# Altium project Isaac MSP430 Subsystem.PrjPcb
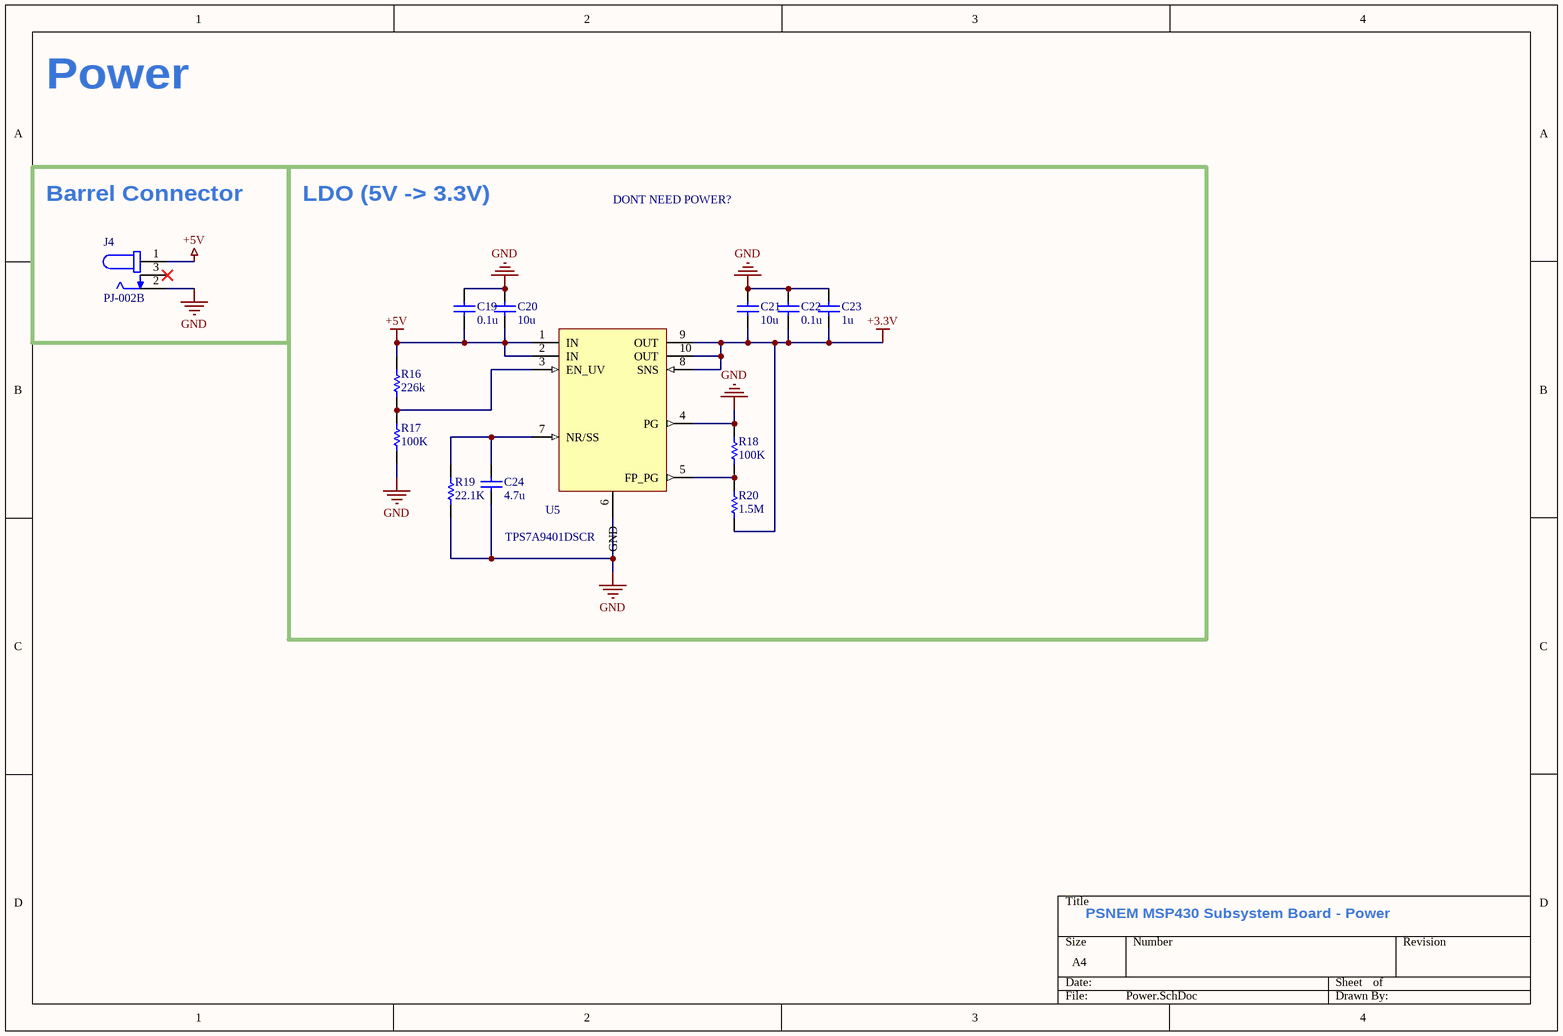
[diagram p0: Power.SchDoc]
4 sheets, 40 parts. Net scope: hierarchical (ports join the sheet entries above them; power ports are global).
Board file: PSNEM-MCU-Subsystem.PcbDoc
Sheets:
  Power.SchDoc
  Overview.SchDoc
    U_Connectors = Connectors.SchDoc
    U_MicroController = MicroController.SchDoc
    U_Connectors = Connectors.SchDoc

## Sheet Power.SchDoc
size A4; SheetNumber: 5; SheetTotal: 5

### Parts
(Parts that share a designator on the sheet are numbered #1, #2 ... from top to bottom, then left to right.)
C19#1  0.1u  [0805 Cap]
C20#1  10u  [0805 Cap]
C21  10u  [0805 Cap]
C22  0.1u  [0805 Cap]
C23  1u  [0805 Cap]
C24  4.7u  [0805 Cap]
J4  PJ-002B  [PJ-002B]
R16#1  226k  [RESC1608X06N]
R17#1  100K  [RESC1608X06N]
R18#1  100K  [RESC1608X06N]
R19#1  22.1K  [RESC1608X06N]
R20  1.5M  [RESC1608X06N]
U5  TPS7A9401DSCR  [TPS7A9401DSCR]

### Blocks framed on the sheet
Barrel Connector: J4
LDO (5V -> 3.3V): C19#1 C20#1 C21-C24 R16#1 R17#1 R18#1 R19#1 R20 U5

### Nets
+3.3V: C21.1 C22.1 C23.2 R20.1 U5.8(SNS) U5.9(OUT) U5.10(OUT)
+5V: C19#1.2 C20#1.1 J4.1 R16#1.2 U5.1(IN) U5.2(IN)
GND: C19#1.1 C20#1.2 C21.2 C22.2 C23.1 C24.1 J4.2 R17#1.1 R18#1.2 R19#1.1 U5.4(PG)
NetC24_2: C24.2 R19#1.2 U5.7(NR/SS)
NetR16#1_1: R16#1.1 R17#1.2 U5.3(EN_UV)
NetR18#1_1: R18#1.1 R20.2 U5.5(FP_PG)

Not connected (* = marked no-connect by the designer): J4 3*; U5 6(GND)

### Notes on the sheet
- Power
- DONT NEED POWER?
- PSNEM MSP430 Subsystem Board - Power

### Library data of the parts
C19#1 C22 = CC0805KRX7R9BB104: 0.1 µF ±10% 50V Ceramic Capacitor X7R 0805 (2012 Metric); value: 0.1u
C20#1 C21 = CL21B106KPQNNNE: 10 µF ±10% 10V Ceramic Capacitor X7R 0805 (2012 Metric); value: 10u
C23 = CC0805KKX7R7BB105: 1 µF ±10% 16V Ceramic Capacitor X7R 0805 (2012 Metric); value: 1u
C24 = CL21B475KOFNFNE: 4.7 µF ±10% 16V Ceramic Capacitor X7R 0805 (2012 Metric); value: 4.7u
J4 = PJ-002B: Power Barrel Connector Jack 2.50mm ID (0.098"), 5.50mm OD (0.217") Through Hole, Right Angle
R16#1 = RN73H1JTTD2263B25: Thin Film Resistors - SMD 226kOhm,0603,0.1%,25; value: 226k
R17#1 R18#1 = ERA-3VRW1003V: Thin Film Resistors - SMD 0603 0.05% 100Kohm 10ppm SMD; value: 100K
R19#1 = TNPW060322K1BEEA: Thin Film Resistors - SMD 22.1Kohms .1% 25ppm; value: 22.1K
R20 = MCT0603MD1504BP500: Thin Film Resistors - SMD .125W 1.5Mohms .1% 0603 25ppm; value: 1.5M
U5 = TPS7A9401DSCR: Linear Voltage Regulator IC Positive Adjustable 1 Output 1A 10-WSON (3x3); Manufacturer: Texas Instruments; Manufacturer PN: TPS7A9401DSCR

## Sheet Overview.SchDoc
size A; SheetNumber: 1; SheetTotal: 4
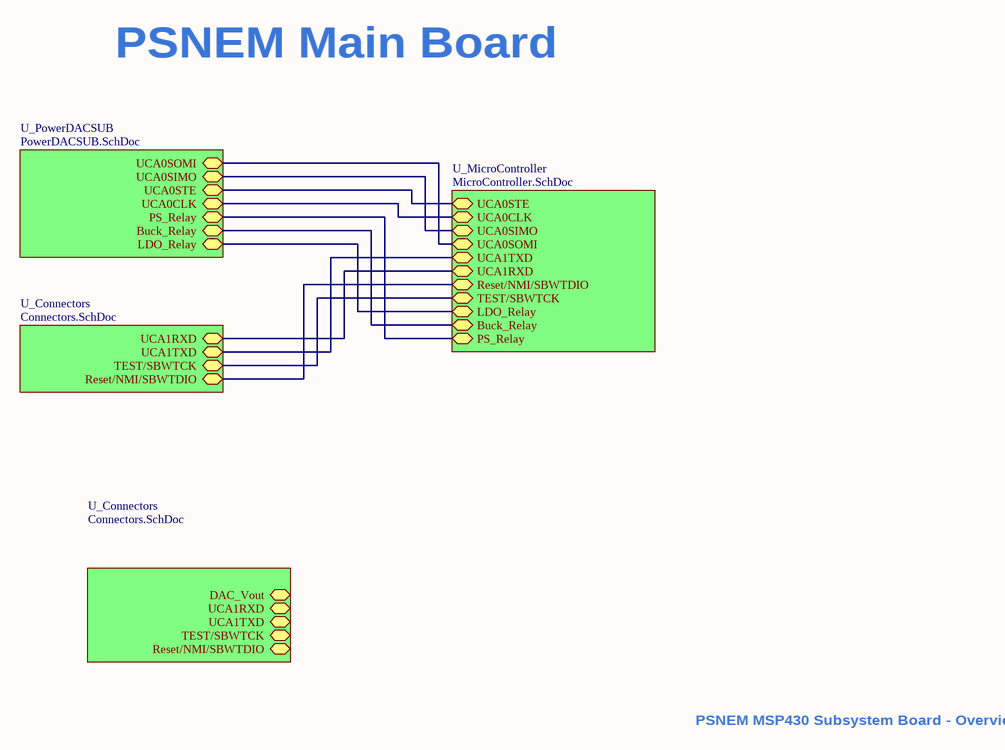
[diagram p1: Overview.SchDoc]

### Sub-sheets
U_Connectors = Connectors.SchDoc: Reset/NMI/SBWTDIO (bidir), TEST/SBWTCK (bidir), UCA1TXD (bidir), UCA1RXD (bidir)
U_Connectors = Connectors.SchDoc: Reset/NMI/SBWTDIO (bidir), TEST/SBWTCK (bidir), UCA1TXD (bidir), UCA1RXD (bidir), DAC_Vout (bidir)
U_MicroController = MicroController.SchDoc: UCA0STE (bidir), UCA0CLK (bidir), UCA0SIMO (bidir), UCA0SOMI (bidir), UCA1TXD (bidir), UCA1RXD (bidir), Reset/NMI/SBWTDIO (bidir), TEST/SBWTCK (bidir), LDO_Relay (bidir), Buck_Relay (bidir), PS_Relay (bidir)
U_PowerDACSUB = PowerDACSUB.SchDoc (file not in this document): LDO_Relay (bidir), Buck_Relay (bidir), PS_Relay (bidir), UCA0CLK (bidir), UCA0STE (bidir), UCA0SIMO (bidir), UCA0SOMI (bidir)

### Nets
NetC18_U_Connectors#1_2: sheet U_Connectors/Reset/NMI/SBWTDIO, sheet U_MicroController/Reset/NMI/SBWTDIO
NetJ3_U_Connectors#1_7: sheet U_Connectors/TEST/SBWTCK, sheet U_MicroController/TEST/SBWTCK
NetJ4_U_Connectors#1_1: sheet U_Connectors/UCA1TXD, sheet U_MicroController/UCA1TXD
NetJ4_U_Connectors#1_3: sheet U_Connectors/UCA1RXD, sheet U_MicroController/UCA1RXD
NetR12_1: sheet U_MicroController/LDO_Relay, sheet U_PowerDACSUB/LDO_Relay
NetR13_1: sheet U_MicroController/Buck_Relay, sheet U_PowerDACSUB/Buck_Relay
NetR14_1: sheet U_MicroController/PS_Relay, sheet U_PowerDACSUB/PS_Relay
NetU4_10: sheet U_MicroController/UCA0STE, sheet U_PowerDACSUB/UCA0STE
NetU4_11: sheet U_MicroController/UCA0CLK, sheet U_PowerDACSUB/UCA0CLK
NetU4_24: sheet U_MicroController/UCA0SIMO, sheet U_PowerDACSUB/UCA0SIMO
NetU4_25: sheet U_MicroController/UCA0SOMI, sheet U_PowerDACSUB/UCA0SOMI

### Notes on the sheet
- PSNEM Main Board
- PSNEM MSP430 Subsystem Board - Overview

## Sheet Connectors.SchDoc
size A4; SheetNumber: 3; SheetTotal: 4
Used 2 times, as channels U_Connectors, U_Connectors. Parts and nets are listed once, with the designators drawn on the sheet.
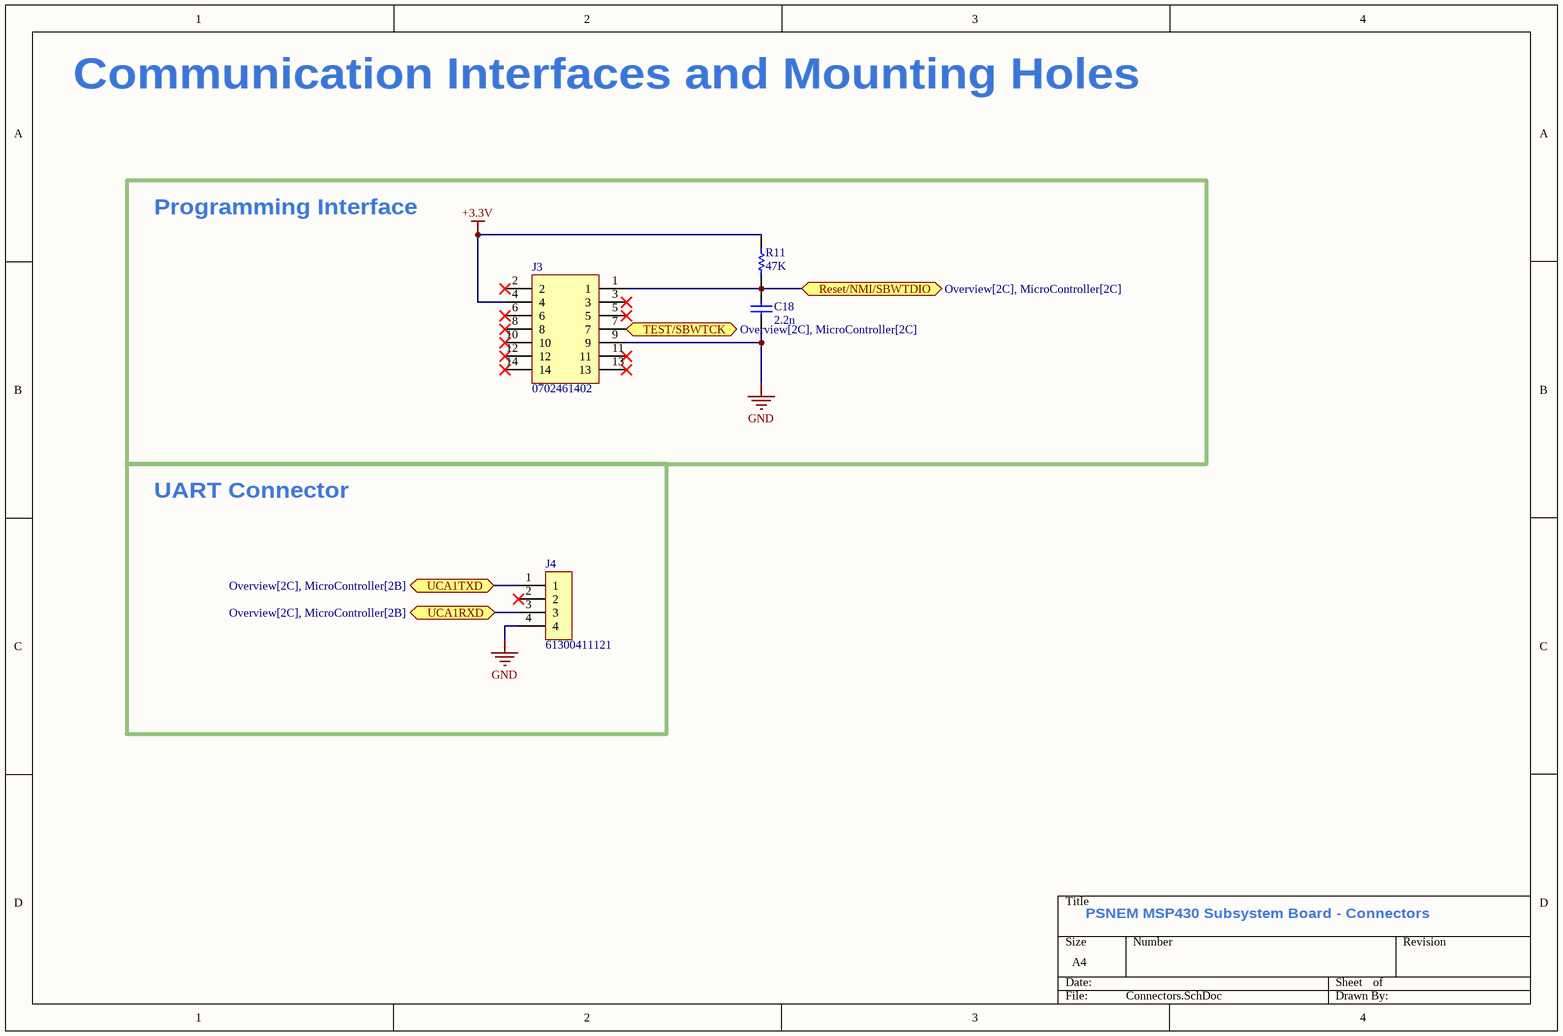
[diagram p2: Connectors.SchDoc]

### Parts
C18  2.2n  [0805 Cap]
J3  0702461402  [0702461402]
J4  61300411121  [61300411121]
R11  47K  [RESC1608X06N]

### Blocks framed on the sheet
Programming Interface: C18 J3 R11
UART Connector: J4

### Ports
Reset/NMI/SBWTDIO (bidir, see Overview[2C], MicroController[2C]), TEST/SBWTCK (bidir, see Overview[2C], MicroController[2C]), UCA1RXD (bidir, see Overview[2C], MicroController[2B]), UCA1TXD (bidir, see Overview[2C], MicroController[2B])

### Nets
+3.3V: J3.4 R11.2
GND: C18.1 J3.9 J4.4
Reset/NMI/SBWTDIO: C18.2 J3.1 R11.1 ; port Reset/NMI/SBWTDIO
TEST/SBWTCK: J3.7 ; port TEST/SBWTCK
UCA1RXD: J4.3 ; port UCA1RXD
UCA1TXD: J4.1 ; port UCA1TXD

Not connected (* = marked no-connect by the designer): J3 2* 3* 5* 6* 8* 10* 11* 12* 13* 14*; J4 2*

### Channels
U_Connectors: designators end in _U_Connectors#1; ports Reset/NMI/SBWTDIO=NetC18_U_Connectors#1_2 TEST/SBWTCK=NetJ3_U_Connectors#1_7 UCA1RXD=NetJ4_U_Connectors#1_3 UCA1TXD=NetJ4_U_Connectors#1_1
U_Connectors: designators end in _U_Connectors#2; ports Reset/NMI/SBWTDIO=NetC18_U_Connectors#2_2 TEST/SBWTCK=NetJ3_U_Connectors#2_7 UCA1RXD=NetJ4_U_Connectors#2_3 UCA1TXD=NetJ4_U_Connectors#2_1

### Notes on the sheet
- Communication Interfaces and Mounting Holes
- PSNEM MSP430 Subsystem Board - Connectors

### Library data of the parts
C18 = CC0805KRX7R9BB222: 2200 pF ±10% 50V Ceramic Capacitor X7R 0805 (2012 Metric); value: 2.2n
J3 = 0702461402: Connector Header Through Hole 14 position 0.100" (2.54mm)
J4 = 61300411121: Connector Header Through Hole 4 position 0.100" (2.54mm)
R11 = ERA-3VEB4702V: Thin Film Resistors - SMD 0603 0.1% 47Kohm 25ppm SMD; value: 47K

## Sheet MicroController.SchDoc
size A3; SheetNumber: 4; SheetTotal: 4
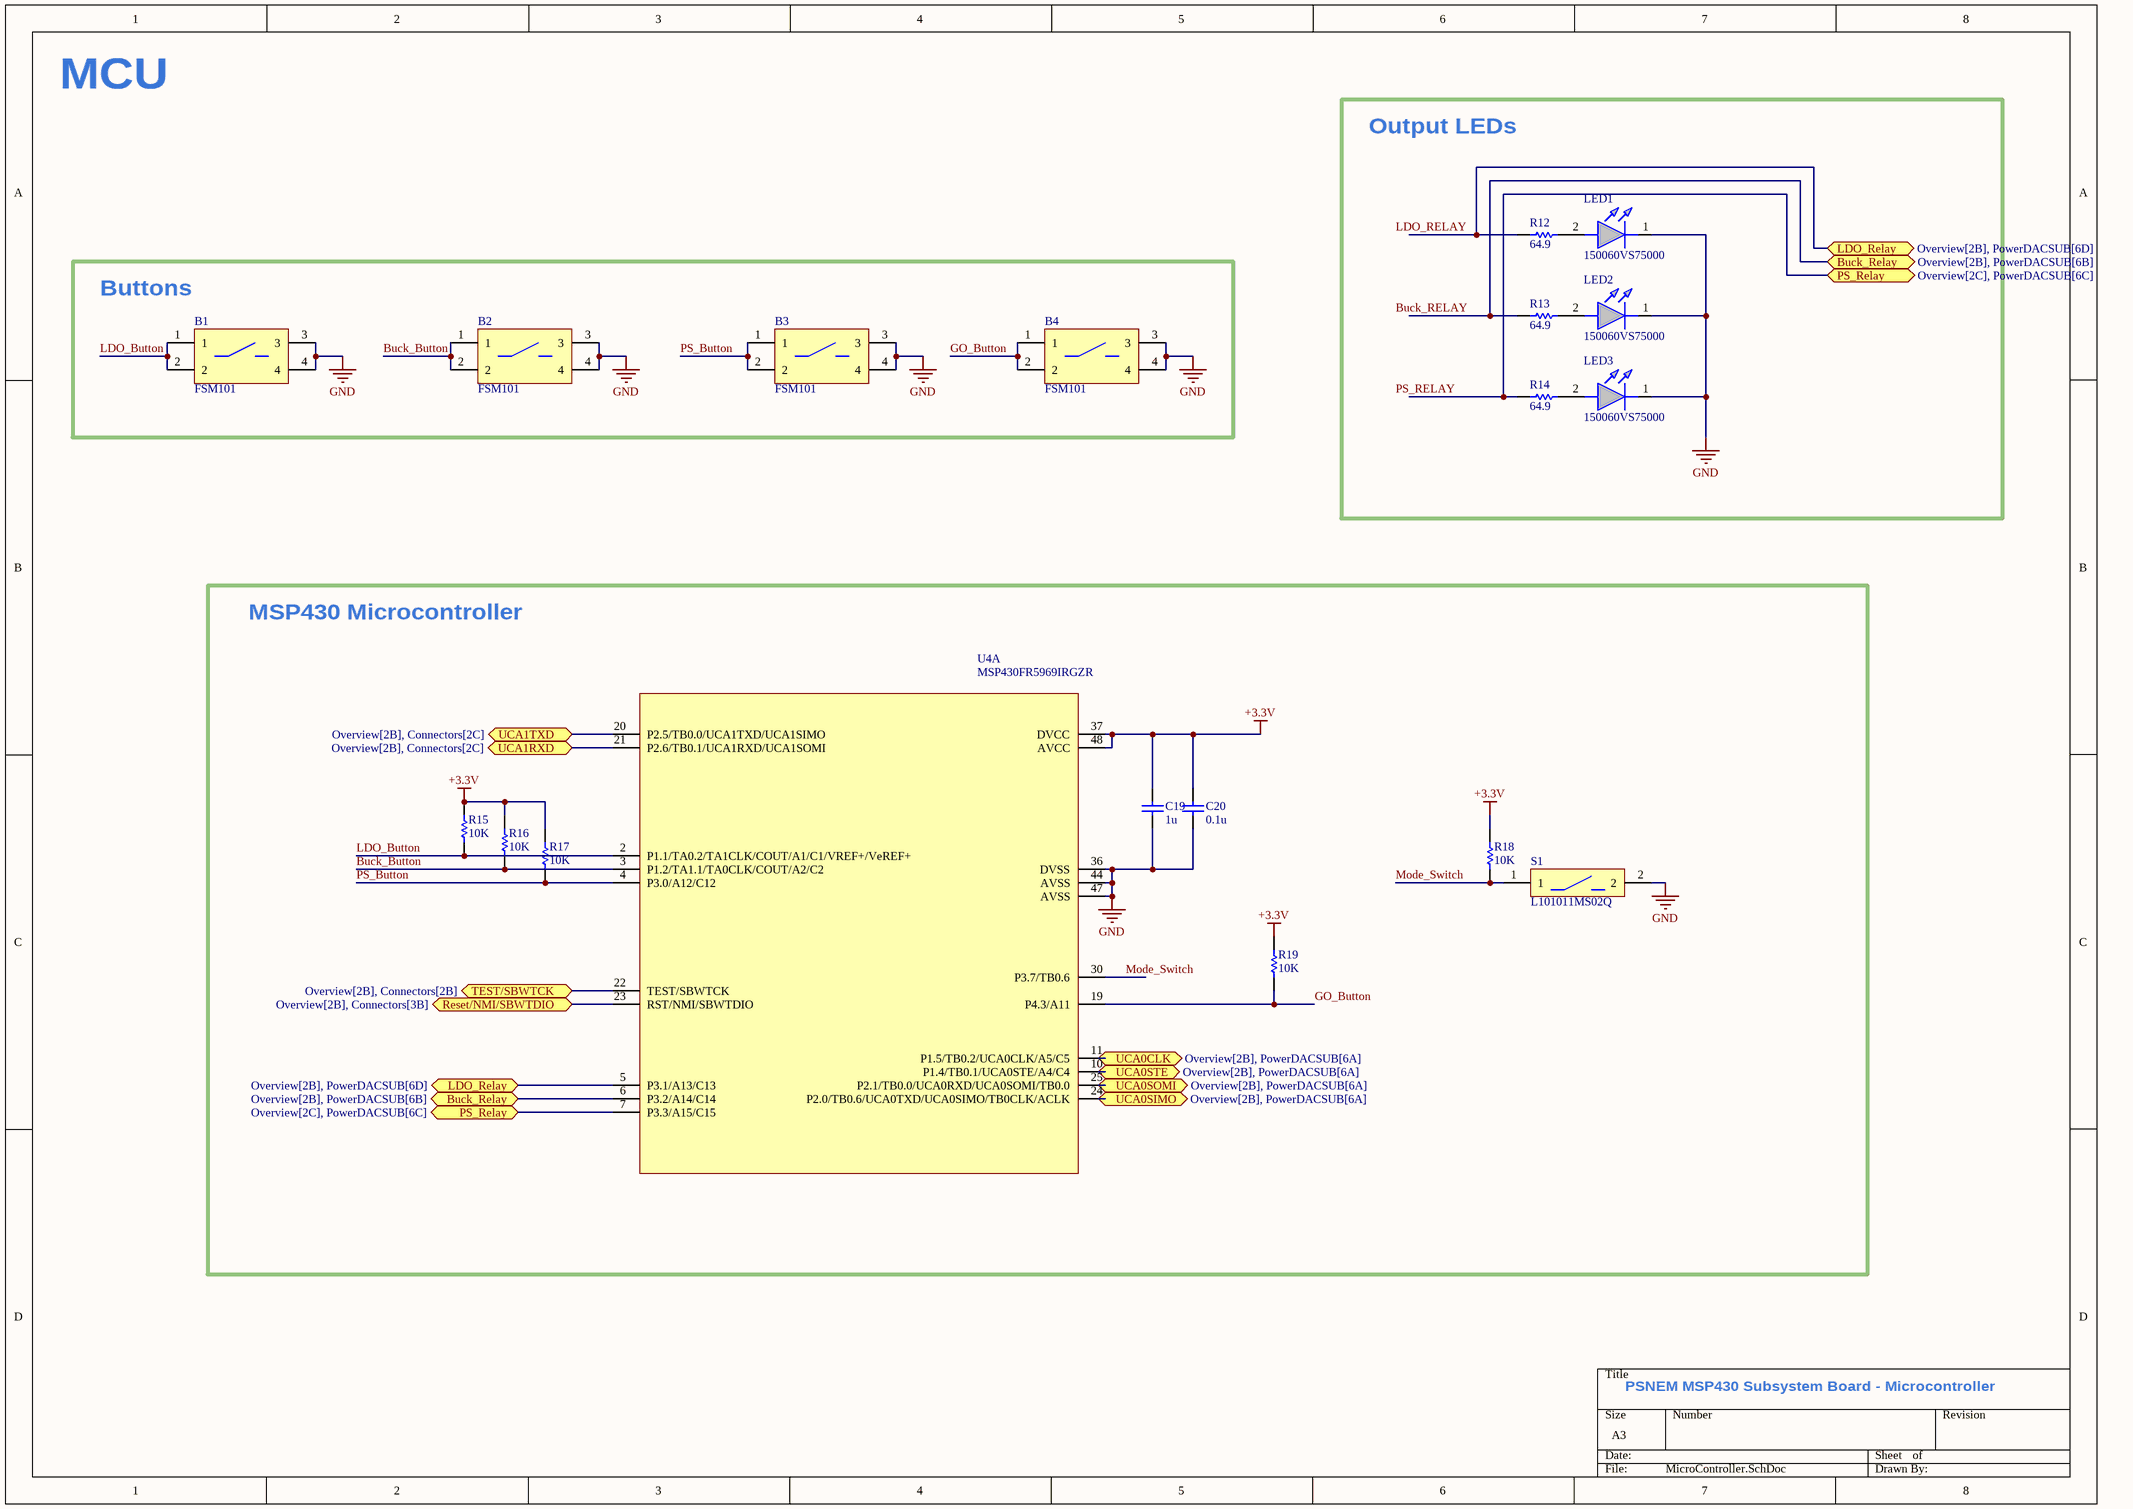
[diagram p3: MicroController.SchDoc]

### Parts
(Parts that share a designator on the sheet are numbered #1, #2 ... from top to bottom, then left to right.)
B1  FSM101  [FSM101]
B2  FSM101  [FSM101]
B3  FSM101  [FSM101]
B4  FSM101  [FSM101]
C19#2  1u  [0805 Cap]
C20#2  0.1u  [0805 Cap]
LED1  150060VS75000  [150060VS75000]
LED2  150060VS75000  [150060VS75000]
LED3  150060VS75000  [150060VS75000]
R12  64.9  [RESC1608X06N]
R13  64.9  [RESC1608X06N]
R14  64.9  [RESC1608X06N]
R15  10K  [RESC1608X06N]
R16#2  10K  [RESC1608X06N]
R17#2  10K  [RESC1608X06N]
R18#2  10K  [RESC1608X06N]
R19#2  10K  [RESC1608X06N]
S1  L101011MS02Q  [L101011MS02Q]
U4  MSP430FR5969IRGZR  [MSP430FR5969IRGZR]  (part A of 2)

### Blocks framed on the sheet
Output LEDs: LED1-LED3 R12-R14
Buttons: B1-B4
MSP430 Microcontroller: C19#2 C20#2 R15 R16#2 R17#2 R18#2 R19#2 S1 U4

### Ports
Buck_Relay (bidir, see Overview[2B], PowerDACSUB[6B]), LDO_Relay (bidir, see Overview[2B], PowerDACSUB[6D]), PS_Relay (bidir, see Overview[2C], PowerDACSUB[6C]), Reset/NMI/SBWTDIO (bidir, see Overview[2B], Connectors[3B]), TEST/SBWTCK (bidir, see Overview[2B], Connectors[2B]), UCA0CLK (bidir, see Overview[2B], PowerDACSUB[6A]), UCA0SIMO (bidir, see Overview[2B], PowerDACSUB[6A]), UCA0SOMI (bidir, see Overview[2B], PowerDACSUB[6A]), UCA0STE (bidir, see Overview[2B], PowerDACSUB[6A]), UCA1RXD (bidir, see Overview[2B], Connectors[2C]), UCA1TXD (bidir, see Overview[2B], Connectors[2C])

### Nets
+3.3V: C19#2.2 C20#2.2 R15.2 R16#2.2 R17#2.2 R18#2.2 R19#2.2 U4.37(DVCC) U4.48(AVCC)
GND: B1.3 B1.4 B2.3 B2.4 B3.3 B3.4 B4.3 B4.4 C19#2.1 C20#2.1 LED1.1(K) LED2.1(K) LED3.1(K) S1.2 U4.36(DVSS) U4.44(AVSS) U4.47(AVSS)
Buck_Button: B2.1 B2.2 R16#2.1 U4.3(P1.2/TA1.1/TA0CLK/COUT/A2/C2)
GO_Button: B4.1 B4.2 R19#2.1 U4.19(P4.3/A11)
LDO_Button: B1.1 B1.2 R15.1 U4.2(P1.1/TA0.2/TA1CLK/COUT/A1/C1/VREF+/VeREF+)
Mode_Switch: R18#2.1 S1.1 U4.30(P3.7/TB0.6)
PS_Button: B3.1 B3.2 R17#2.1 U4.4(P3.0/A12/C12)
NetC18_U_Connectors#1_2: U4.23(RST/NMI/SBWTDIO) ; port Reset/NMI/SBWTDIO
NetJ3_U_Connectors#1_7: U4.22(TEST/SBWTCK) ; port TEST/SBWTCK
NetJ4_U_Connectors#1_1: U4.20(P2.5/TB0.0/UCA1TXD/UCA1SIMO) ; port UCA1TXD
NetJ4_U_Connectors#1_3: U4.21(P2.6/TB0.1/UCA1RXD/UCA1SOMI) ; port UCA1RXD
NetLED1_2: LED1.2(A) R12.2
NetLED2_2: LED2.2(A) R13.2
NetLED3_2: LED3.2(A) R14.2
NetR12_1: R12.1 U4.5(P3.1/A13/C13) ; port LDO_Relay
NetR13_1: R13.1 U4.6(P3.2/A14/C14) ; port Buck_Relay
NetR14_1: R14.1 U4.7(P3.3/A15/C15) ; port PS_Relay
NetU4_10: U4.10(P1.4/TB0.1/UCA0STE/A4/C4) ; port UCA0STE
NetU4_11: U4.11(P1.5/TB0.2/UCA0CLK/A5/C5) ; port UCA0CLK
NetU4_24: U4.24(P2.0/TB0.6/UCA0TXD/UCA0SIMO/TB0CLK/ACLK) ; port UCA0SIMO
NetU4_25: U4.25(P2.1/TB0.0/UCA0RXD/UCA0SOMI/TB0.0) ; port UCA0SOMI

### Notes on the sheet
- MCU
- PSNEM MSP430 Subsystem Board - Microcontroller
- Labels drawn without touching a wire or pin: Buck_RELAY, LDO_RELAY, PS_RELAY

### Library data of the parts
B1-B4 = FSM101: Tactile Switch SPST-NO Top Actuated Through Hole
C19#2 = CC0805KKX7R7BB105: as C23 on sheet Power; value: 1u
C20#2 = CC0805KRX7R9BB104: as C19#1 on sheet Power; value: 0.1u
LED1-LED3 = 150060VS75000: LED GREEN CLEAR 0603 SMD
R12-R14 = ERA-3AEB64R9V: Thin Film Resistors - SMD 0603 64.9ohm 0.1% 25ppm; value: 64.9
R15 R16#2 R17#2 R18#2 R19#2 = CRCW060310K0FKEAHP: RES SMD 10K OHM 1% 1/3W 0603; value: 10K
S1 = L101011MS02Q: SWITCH SLIDE SPST 4A 125V
U4 = MSP430FR5969IRGZR: MSP430 CPUXV2 MSP430™ FRAM Microcontroller IC 16-Bit 16MHz 64KB (64K x 8) FRAM 48-VQFN (7x7)

## Nets that join several sheets
+3.3V: Power (7 pins), U_Connectors (J3_U_Connectors#1.4 R11_U_Connectors#1.2), MicroController (9 pins), U_Connectors (J3_U_Connectors#2.4 R11_U_Connectors#2.2)
GND: Power (11 pins), U_Connectors (C18_U_Connectors#1.1 J3_U_Connectors#1.9 J4_U_Connectors#1.4), MicroController (17 pins), U_Connectors (C18_U_Connectors#2.1 J3_U_Connectors#2.9 J4_U_Connectors#2.4)
NetC18_U_Connectors#1_2: U_Connectors (C18_U_Connectors#1.2 J3_U_Connectors#1.1 R11_U_Connectors#1.1), MicroController (U4.23)
NetJ3_U_Connectors#1_7: U_Connectors (J3_U_Connectors#1.7), MicroController (U4.22)
NetJ4_U_Connectors#1_1: U_Connectors (J4_U_Connectors#1.1), MicroController (U4.20)
NetJ4_U_Connectors#1_3: U_Connectors (J4_U_Connectors#1.3), MicroController (U4.21)